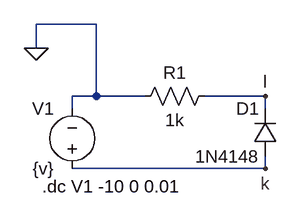
[diagram p0: schematic Draft2.asc]
Draft2.asc, the LTspice schematic file:
Version 4
SHEET 1 880 680
WIRE 128 -16 48 -16
WIRE 48 16 48 -16
WIRE 128 80 128 -16
WIRE 128 80 96 80
WIRE 192 80 128 80
WIRE 352 80 272 80
WIRE 96 96 96 80
WIRE 352 96 352 80
WIRE 352 176 352 160
WIRE 352 176 96 176
FLAG 352 176 k
FLAG 352 80 l
FLAG 48 16 0
SYMBOL res 288 64 R90
WINDOW 0 0 56 VBottom 2
WINDOW 3 32 56 VTop 2
SYMATTR InstName R1
SYMATTR Value 1k
SYMBOL diode 368 160 R180
WINDOW 0 24 64 Left 2
WINDOW 3 24 0 Left 2
SYMATTR InstName D1
SYMATTR Value 1N4148
SYMBOL voltage 96 192 R180
WINDOW 0 24 96 Left 2
WINDOW 3 24 16 Left 2
WINDOW 123 0 0 Left 0
WINDOW 39 0 0 Left 0
SYMATTR InstName V1
SYMATTR Value {v}
TEXT 56 200 Left 2 !.dc V1 -10 0 0.01

The netlist it stands for:
* Draft2.asc
R1 l 0 1k
D1 k l 1N4148
V1 k 0 {v}
.model D D
.lib standard.dio
.dc V1 -10 0 0.01
.backanno
.end